# Altium project QUTMS-AMU-2021.PrjPcb (part 3 of 3)
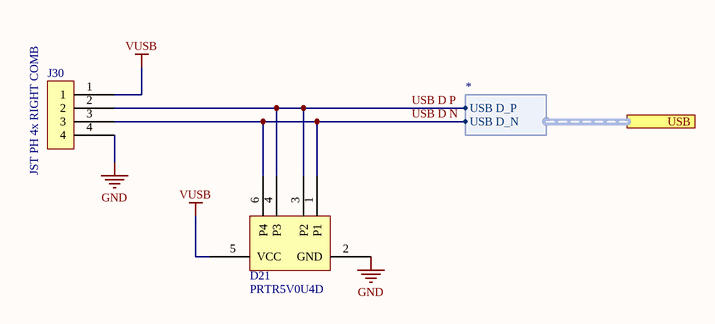
[diagram p25: AMU-S28-V00-USBCProtection.SchDoc]

## Nets that join several sheets
3V3: AMU-S02-V00-PSU3V3 (6 pins), AMU-S06-V00-CANACC (C20.2 J5.1 J7.1 U6.3), AMU-S04-V00-Microcontroller (21 pins), AMU-S15-V00-BSPDSystem (C35#1.2 U11.14), AMU-S16-V00-BSPDDelay (C36.2 R41.2 R42.1 U12.8), BSPD System/BSPD Window Comparitor (R44_BSPD_System_BSPD_Window_Comparitor#1.2 R46_BSPD_System_BSPD_Window_Comparitor#1.2), BSPD System/BSPD Window Comparitor (R44_BSPD_System_BSPD_Window_Comparitor#2.2 R46_BSPD_System_BSPD_Window_Comparitor#2.2), AMU-S18-V00-CURRENTCurrentInterface (J17#1.3), AMU-S22-V00-CURRENT5kWAlarm (J17#2.3), AMU-S02-V00-12VProtection (C49.2 J21#2.1 J23.1 U18.3), AMU-S08-V00-AMSIDCloops (R21.2), AMU-S05-V00-CANMAIN (C19.2 J2.1 J4.1 U5.3)
3V5: AMU-S03-V00-PSU3V5 (6 pins), AMU-S08-V00-AMSIDCloops (J8.6 J9.6 J10.6 J11.6)
5V: AMU-S23-V00-CURRENTPSU5V (5 pins), AMU-S07-V00-AMSShutdown (K1.13), AMU-S26-V00-DAUGHTERShutdown (K4.13), AMU-S13-V00-BSPDShutdownRelay (K?#1.13), AMU-S18-V00-CURRENTCurrentInterface (J17#1.4), AMU-S22-V00-CURRENT5kWAlarm (J17#2.4)
+12: AMU-S26-V00-DAUGHTERShutdown (D17.K K4.1), AMU-S27-V00-MX120G-Interface (R93.2)
GND: AMU-S02-V00-PSU3V3 (8 pins), AMU-S03-V00-PSU3V5 (8 pins), AMU-S06-V00-CANACC (C20.1 D5.3 U6.2 U6.8), AMU-S10-V00-AMSContactorInterface (C22.K C23.K D8.K K2.5), AMS Contactor Interface/PROFET 1 (7 pins), AMS Contactor Interface/PROFET 3 (7 pins), AMS Contactor Interface/PROFET 2 (7 pins), AMU-S04-V00-Microcontroller (28 pins), AMU-S23-V00-CURRENTPSU5V (6 pins), AMU-S07-V00-AMSShutdown (Q2.S), AMU-S26-V00-DAUGHTERShutdown (Q13.D), AMU-S12-V00-TSALControl (10 pins), AMU-S27-V00-MX120G-Interface (6 pins), AMU-S13-V00-BSPDShutdownRelay (Q8#2.S R36#2.1), AMU-S15-V00-BSPDSystem (C35#1.1 U11.7), AMU-S16-V00-BSPDDelay (8 pins), BSPD System/BSPD Window Comparitor (9 pins), BSPD System/BSPD Window Comparitor (9 pins), AMU-S18-V00-CURRENTCurrentInterface (R55.1), AMU-S19-V00-CURRENT5kWSimulation (D13.A D14.A Q9#2.S R57.1), AMU-S20-V00-CURRENTLEMInterface (C40.1 C41.2 R58#2.1 U14.4), AMU-S21-V00-CURRENT5kWDetection (7 pins), AMU-S22-V00-CURRENT5kWAlarm (R66.1 R69.1 R70.1 R71.1), AMU-S02-V00-12VProtection (26 pins), AMU-S08-V00-AMSIDCloops (13 pins), AMU-S05-V00-CANMAIN (C19.1 D4.3 U5.2 U5.8), AMU-S28-V00-USBCProtection (D21.2 J30.4)
HV ON: AMU-S02-V00-PSU3V3 (C2.2 C3.2 U1.4 U1.5), AMU-S03-V00-PSU3V5 (C7.2 C8.2 U2.4 U2.5), AMU-S10-V00-AMSContactorInterface (K2.2 Q5.D), AMU-S23-V00-CURRENTPSU5V (C45.2 U16.4 U16.5), AMU-S07-V00-AMSShutdown (D7.K K1.1), AMU-S12-V00-TSALControl (9 pins), AMU-S13-V00-BSPDShutdownRelay (D11#2.K K?#3.1), BSPD System/BSPD Window Comparitor (6 pins), BSPD System/BSPD Window Comparitor (6 pins), AMU-S18-V00-CURRENTCurrentInterface (J17#1.1), AMU-S19-V00-CURRENT5kWSimulation (J19#1.2), AMU-S22-V00-CURRENT5kWAlarm (J17#2.1), AMU-S02-V00-12VProtection (16 pins), AMU-S08-V00-AMSIDCloops (6 pins)
LEM: AMU-S27-V00-MX120G-Interface (J26.4), AMU-S18-V00-CURRENTCurrentInterface (J17#1.2 R54.2), AMU-S20-V00-CURRENTLEMInterface (C41.1 U14.8), AMU-S21-V00-CURRENT5kWDetection (C43.1 R62.2 R63.1 U15.8)
VUSB: AMU-S02-V00-12VProtection (D?.5 J18.1), AMU-S28-V00-USBCProtection (D21.5 J30.1)
5kW ALARM: BSPD System/BSPD Window Comparitor (R45_BSPD_System_BSPD_Window_Comparitor#2.2 U13_BSPD_System_BSPD_Window_Comparitor#2.2 U13_BSPD_System_BSPD_Window_Comparitor#2.5), AMU-S22-V00-CURRENT5kWAlarm (Q12.S R71.2)
5kW ALERT: AMU-S04-V00-Microcontroller (U3.24), AMU-S21-V00-CURRENT5kWDetection (TP22.1 U15.1), AMU-S22-V00-CURRENT5kWAlarm (R68.1)
5kW CALIBRATION: AMU-S04-V00-Microcontroller (U3.25), AMU-S21-V00-CURRENT5kWDetection (TP23.1)
12V HV ACTIVE: AMU-S12-V00-TSALControl (Q8#1.D), AMU-S27-V00-MX120G-Interface (J24.8)
12V HV ACTIVE FLASH: AMU-S12-V00-TSALControl (Q7.D), AMU-S27-V00-MX120G-Interface (J24.7)
12V HV INACTIVE: AMU-S12-V00-TSALControl (Q9#1.D), AMU-S27-V00-MX120G-Interface (J24.9)
ALM CTRL: AMU-S04-V00-Microcontroller (U3.30), AMU-S07-V00-AMSShutdown (R19.1)
BMS CTRL: AMU-S04-V00-Microcontroller (U3.38), AMU-S08-V00-AMSIDCloops (R25.1)
BSPD1: AMU-S15-V00-BSPDSystem (U11.1), BSPD System/BSPD Window Comparitor (R44_BSPD_System_BSPD_Window_Comparitor#1.1 U13_BSPD_System_BSPD_Window_Comparitor#1.1)
BSPD2: AMU-S15-V00-BSPDSystem (U11.2), BSPD System/BSPD Window Comparitor (R46_BSPD_System_BSPD_Window_Comparitor#1.1 U13_BSPD_System_BSPD_Window_Comparitor#1.7)
BSPD3: AMU-S15-V00-BSPDSystem (U11.4), BSPD System/BSPD Window Comparitor (R44_BSPD_System_BSPD_Window_Comparitor#2.1 U13_BSPD_System_BSPD_Window_Comparitor#2.1)
BSPD4: AMU-S15-V00-BSPDSystem (U11.5), BSPD System/BSPD Window Comparitor (R46_BSPD_System_BSPD_Window_Comparitor#2.1 U13_BSPD_System_BSPD_Window_Comparitor#2.7)
BSPD5: AMU-S15-V00-BSPDSystem (U11.8), AMU-S16-V00-BSPDDelay (R40.1)
BSPD6: AMU-S13-V00-BSPDShutdownRelay (R35#2.1), AMU-S16-V00-BSPDDelay (U12.1)
CAN ACC H: AMU-S06-V00-CANACC (D5.2 J6.1 TP15.1 U6.7), AMU-S27-V00-MX120G-Interface (J27.1), AMU-S08-V00-AMSIDCloops (J8.3 J9.3 J10.3 J11.3)
CAN ACC L: AMU-S06-V00-CANACC (D5.1 R18.1 TP17.1 U6.6), AMU-S27-V00-MX120G-Interface (J27.2), AMU-S08-V00-AMSIDCloops (J8.4 J9.4 J10.4 J11.4)
CAN ACC RX: AMU-S06-V00-CANACC (R17.1 TP18.1 U6.4), AMU-S04-V00-Microcontroller (U3.61)
CAN ACC TX: AMU-S06-V00-CANACC (R16.1 TP16.1 U6.1), AMU-S04-V00-Microcontroller (U3.62)
CAN MAIN RX: AMU-S04-V00-Microcontroller (U3.57), AMU-S02-V00-12VProtection (R89.1 TP34.1 U18.4)
CAN MAIN TX: AMU-S04-V00-Microcontroller (U3.58), AMU-S02-V00-12VProtection (R88.1 TP32.1 U18.1)
CHAIN AMS-IMD: AMU-S07-V00-AMSShutdown (K1.8), AMU-S26-V00-DAUGHTERShutdown (K4.8)
CHAIN BSPD-AMS: AMU-S07-V00-AMSShutdown (K1.4), AMU-S13-V00-BSPDShutdownRelay (K?#2.8)
CHAIN END: AMU-S10-V00-AMSContactorInterface (Q5.G), AMU-S27-V00-MX120G-Interface (J24.11)
CHAIN IN: AMU-S27-V00-MX120G-Interface (J24.1), AMU-S13-V00-BSPDShutdownRelay (K?#2.4)
CHAIN OUT: AMU-S26-V00-DAUGHTERShutdown (K4.4), AMU-S27-V00-MX120G-Interface (J24.2)
CONTACTOR INTERFACE.HVA+: AMS Contactor Interface/PROFET 1 (C28_PROFET_1.1 Q6_PROFET_1.13), AMU-S27-V00-MX120G-Interface (J27.7)
CONTACTOR INTERFACE.HVA-: AMS Contactor Interface/PROFET 2 (C28_PROFET_2.1 Q6_PROFET_2.13), AMU-S27-V00-MX120G-Interface (J27.9)
CONTACTOR INTERFACE.HVB+: AMS Contactor Interface/PROFET 1 (C27_PROFET_1.1 Q6_PROFET_1.9), AMU-S27-V00-MX120G-Interface (J27.8)
CONTACTOR INTERFACE.HVB-: AMS Contactor Interface/PROFET 2 (C27_PROFET_2.1 Q6_PROFET_2.9), AMU-S27-V00-MX120G-Interface (J27.10)
CONTACTOR INTERFACE.PRECHG: AMS Contactor Interface/PROFET 3 (C28_PROFET_3.1 Q6_PROFET_3.13), AMU-S27-V00-MX120G-Interface (J27.11)
CURRENT VLTG: AMU-S04-V00-Microcontroller (U3.26), AMU-S20-V00-CURRENTLEMInterface (C40.2 R61.2 TP19.1 U14.7), AMU-S21-V00-CURRENT5kWDetection (U15.2)
HV IN: AMU-S12-V00-TSALControl (R36#1.2), AMU-S27-V00-MX120G-Interface (J25.1)
HV OUT: AMU-S12-V00-TSALControl (U10.2), AMU-S27-V00-MX120G-Interface (J25.2)
IDC ALARM: AMU-S04-V00-Microcontroller (U3.37), AMU-S08-V00-AMSIDCloops (R21.1 U7.1)
IMD MLV: AMU-S04-V00-Microcontroller (U3.28), AMU-S27-V00-MX120G-Interface (R94.1 R97.2)
IMD MV: AMU-S04-V00-Microcontroller (U3.27), AMU-S27-V00-MX120G-Interface (R91.1 R92.2)
IMD OUT.IMD STATUS: AMU-S04-V00-Microcontroller (U3.29 U3.46), AMU-S26-V00-DAUGHTERShutdown (R75.1), AMU-S27-V00-MX120G-Interface (R98.1 R99.2)
LEM REF: AMU-S27-V00-MX120G-Interface (J26.5), AMU-S20-V00-CURRENTLEMInterface (TP20.1 U14.2)
LEM SIG: AMU-S27-V00-MX120G-Interface (J26.6), AMU-S20-V00-CURRENTLEMInterface (TP21.1 U14.6)
NetR54_1: AMU-S04-V00-Microcontroller (U3.22), AMU-S18-V00-CURRENTCurrentInterface (R54.1 R55.2)
NetR67_1: AMU-S04-V00-Microcontroller (U3.23), AMU-S22-V00-CURRENT5kWAlarm (R67.1 R69.2)
PEDAL IN: AMU-S27-V00-MX120G-Interface (J24.6), BSPD System/BSPD Window Comparitor (R45_BSPD_System_BSPD_Window_Comparitor#1.2 U13_BSPD_System_BSPD_Window_Comparitor#1.2 U13_BSPD_System_BSPD_Window_Comparitor#1.5)
PFET1 ADC: AMS Contactor Interface/PROFET 1 (C26_PROFET_1.2 R30_PROFET_1.1), AMU-S04-V00-Microcontroller (U3.8)
PFET1 DEN: AMS Contactor Interface/PROFET 1 (R28_PROFET_1.1), AMU-S04-V00-Microcontroller (U3.3)
PFET1 DSEL: AMS Contactor Interface/PROFET 1 (R29_PROFET_1.1), AMU-S04-V00-Microcontroller (U3.2)
PFET1 IN0: AMS Contactor Interface/PROFET 1 (R26_PROFET_1.1), AMU-S04-V00-Microcontroller (U3.4)
PFET1 IN1: AMS Contactor Interface/PROFET 1 (R27_PROFET_1.1), AMU-S04-V00-Microcontroller (U3.59)
PFET2 ADC: AMS Contactor Interface/PROFET 2 (C26_PROFET_2.2 R30_PROFET_2.1), AMU-S04-V00-Microcontroller (U3.9)
PFET2 DEN: AMS Contactor Interface/PROFET 2 (R28_PROFET_2.1), AMU-S04-V00-Microcontroller (U3.55)
PFET2 DSEL: AMS Contactor Interface/PROFET 2 (R29_PROFET_2.1), AMU-S04-V00-Microcontroller (U3.54)
PFET2 IN0: AMS Contactor Interface/PROFET 2 (R26_PROFET_2.1), AMU-S04-V00-Microcontroller (U3.56)
PFET2 IN1: AMS Contactor Interface/PROFET 2 (R27_PROFET_2.1), AMU-S04-V00-Microcontroller (U3.53)
PFET3 ADC: AMS Contactor Interface/PROFET 3 (C26_PROFET_3.2 R30_PROFET_3.1), AMU-S04-V00-Microcontroller (U3.10)
PFET3 DEN: AMS Contactor Interface/PROFET 3 (R28_PROFET_3.1), AMU-S04-V00-Microcontroller (U3.51)
PFET3 DSEL: AMS Contactor Interface/PROFET 3 (R29_PROFET_3.1), AMU-S04-V00-Microcontroller (U3.50)
PFET3 IN0: AMS Contactor Interface/PROFET 3 (R26_PROFET_3.1), AMU-S04-V00-Microcontroller (U3.52)
PFET3 IN1: AMS Contactor Interface/PROFET 3 (R27_PROFET_3.1), AMU-S04-V00-Microcontroller (U3.49)
SHDN DETECT AMS: AMU-S07-V00-AMSShutdown (K1.9), AMU-S27-V00-MX120G-Interface (J24.3)
SHDN DETECT BSPD: AMU-S27-V00-MX120G-Interface (J24.5), AMU-S13-V00-BSPDShutdownRelay (K?#1.9)
SHDN DETECT IMD: AMU-S26-V00-DAUGHTERShutdown (K4.9), AMU-S27-V00-MX120G-Interface (J24.4)
SIM TRIG: AMU-S27-V00-MX120G-Interface (J26.3), AMU-S19-V00-CURRENT5kWSimulation (D13.K R56.1)
USB DM: AMU-S04-V00-Microcontroller (U3.44), AMU-S02-V00-12VProtection (R77.2)
USB DP: AMU-S04-V00-Microcontroller (U3.45), AMU-S02-V00-12VProtection (R76.2)
VS: AMU-S10-V00-AMSContactorInterface (K2.3), AMS Contactor Interface/PROFET 1 (C24_PROFET_1.2 C25_PROFET_1.2 Q6_PROFET_1.15), AMS Contactor Interface/PROFET 3 (C24_PROFET_3.2 C25_PROFET_3.2 Q6_PROFET_3.15), AMS Contactor Interface/PROFET 2 (C24_PROFET_2.2 C25_PROFET_2.2 Q6_PROFET_2.15)